# Altium schematic sheet 10_ZynTra-Connectors.SchDoc
size 241 x 203 mm; SheetNumber: 10; SheetTotal: 10
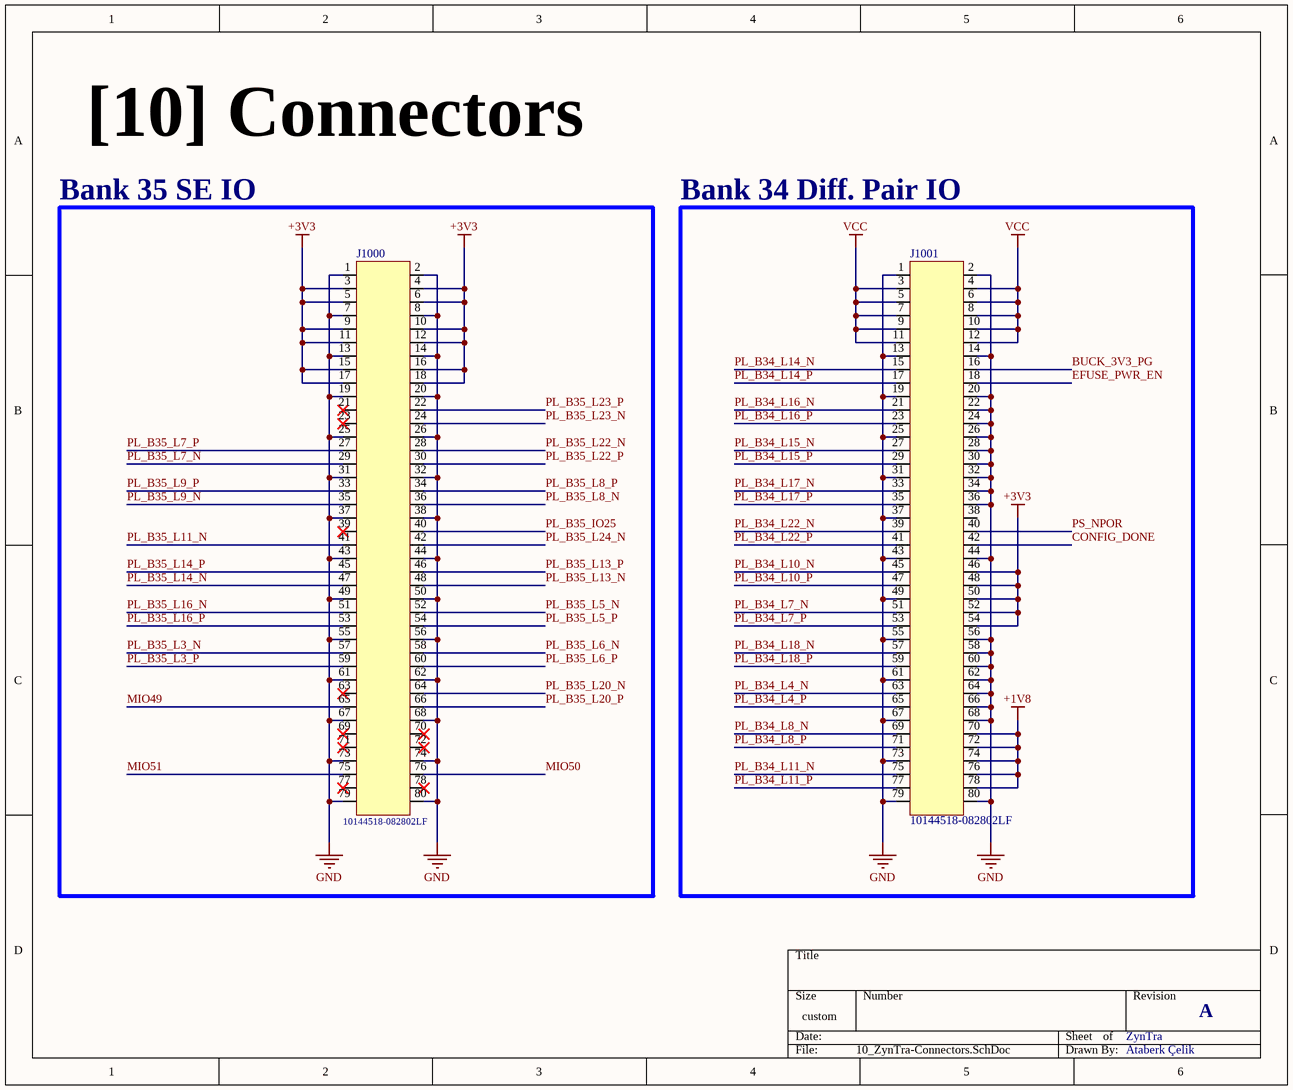
[diagram p0: 10_ZynTra-Connectors.SchDoc]

## Parts
J1000  10144518-082802LF  [10144518-082802LF]
J1001  10144518-082802LF  [10144518-082802LF]

## Blocks framed on the sheet
Bank 35 SE IO: J1000
Bank 34 Diff. Pair IO: J1001

## Nets
+1V8: J1001.70 J1001.72 J1001.74 J1001.76 J1001.78
+3V3: J1000.3 J1000.4 J1000.5 J1000.6 J1000.9 J1000.10 J1000.11 J1000.12 J1000.15 J1000.16 J1000.17 J1000.18 J1001.46 J1001.48 J1001.50 J1001.52 J1001.54
GND: J1000.1 J1000.2 J1000.7 J1000.8 J1000.13 J1000.14 J1000.19 J1000.20 J1000.25 J1000.26 J1000.31 J1000.32 J1000.37 J1000.38 J1000.43 J1000.44 J1000.49 J1000.50 J1000.55 J1000.56 J1000.61 J1000.62 J1000.67 J1000.68 J1000.73 J1000.74 J1000.79 J1000.80 J1001.1 J1001.2 J1001.13 J1001.14 J1001.19 J1001.20 J1001.22 J1001.24 J1001.25 J1001.26 J1001.28 J1001.30 J1001.31 J1001.32 J1001.34 J1001.36 J1001.37 J1001.43 J1001.44 J1001.49 J1001.55 J1001.56 J1001.58 J1001.60 J1001.61 J1001.62 J1001.64 J1001.66 J1001.67 J1001.68 J1001.73 J1001.79 J1001.80
VCC: J1001.3 J1001.4 J1001.5 J1001.6 J1001.7 J1001.8 J1001.9 J1001.10 J1001.11 J1001.12
BUCK_3V3_PG: J1001.16
CONFIG_DONE: J1001.42
EFUSE_PWR_EN: J1001.18
MIO49: J1000.65
MIO50: J1000.76
MIO51: J1000.75
PL_B34_L4_N: J1001.63
PL_B34_L4_P: J1001.65
PL_B34_L7_N: J1001.51
PL_B34_L7_P: J1001.53
PL_B34_L8_N: J1001.69
PL_B34_L8_P: J1001.71
PL_B34_L10_N: J1001.45
PL_B34_L10_P: J1001.47
PL_B34_L11_N: J1001.75
PL_B34_L11_P: J1001.77
PL_B34_L14_N: J1001.15
PL_B34_L14_P: J1001.17
PL_B34_L15_N: J1001.27
PL_B34_L15_P: J1001.29
PL_B34_L16_N: J1001.21
PL_B34_L16_P: J1001.23
PL_B34_L17_N: J1001.33
PL_B34_L17_P: J1001.35
PL_B34_L18_N: J1001.57
PL_B34_L18_P: J1001.59
PL_B34_L22_N: J1001.39
PL_B34_L22_P: J1001.41
PL_B35_IO25: J1000.40
PL_B35_L3_N: J1000.57
PL_B35_L3_P: J1000.59
PL_B35_L5_N: J1000.52
PL_B35_L5_P: J1000.54
PL_B35_L6_N: J1000.58
PL_B35_L6_P: J1000.60
PL_B35_L7_N: J1000.29
PL_B35_L7_P: J1000.27
PL_B35_L8_N: J1000.36
PL_B35_L8_P: J1000.34
PL_B35_L9_N: J1000.35
PL_B35_L9_P: J1000.33
PL_B35_L11_N: J1000.41
PL_B35_L13_N: J1000.48
PL_B35_L13_P: J1000.46
PL_B35_L14_N: J1000.47
PL_B35_L14_P: J1000.45
PL_B35_L16_N: J1000.51
PL_B35_L16_P: J1000.53
PL_B35_L20_N: J1000.64
PL_B35_L20_P: J1000.66
PL_B35_L22_N: J1000.28
PL_B35_L22_P: J1000.30
PL_B35_L23_N: J1000.24
PL_B35_L23_P: J1000.22
PL_B35_L24_N: J1000.42
PS_NPOR: J1001.40

Not connected (* = marked no-connect by the designer): J1000 21* 23* 39* 63* 69* 70* 71* 72* 77* 78*; J1001 38

## Notes on the sheet
- [10] Connectors
- ZynTra
- A
- Ataberk Çelik

## Library data of the parts
J1000 J1001 = 10144518-082802LF: BergStak® Lite 0.80mm, Board-to-Board Connector, 80 Positions, Dual Row, Vertical Header; Manufacturer: Amphenol; Manufacturer Part Number: 10144518-082802LF